# EAGLE design main_board (EAGLE 6.6.0)
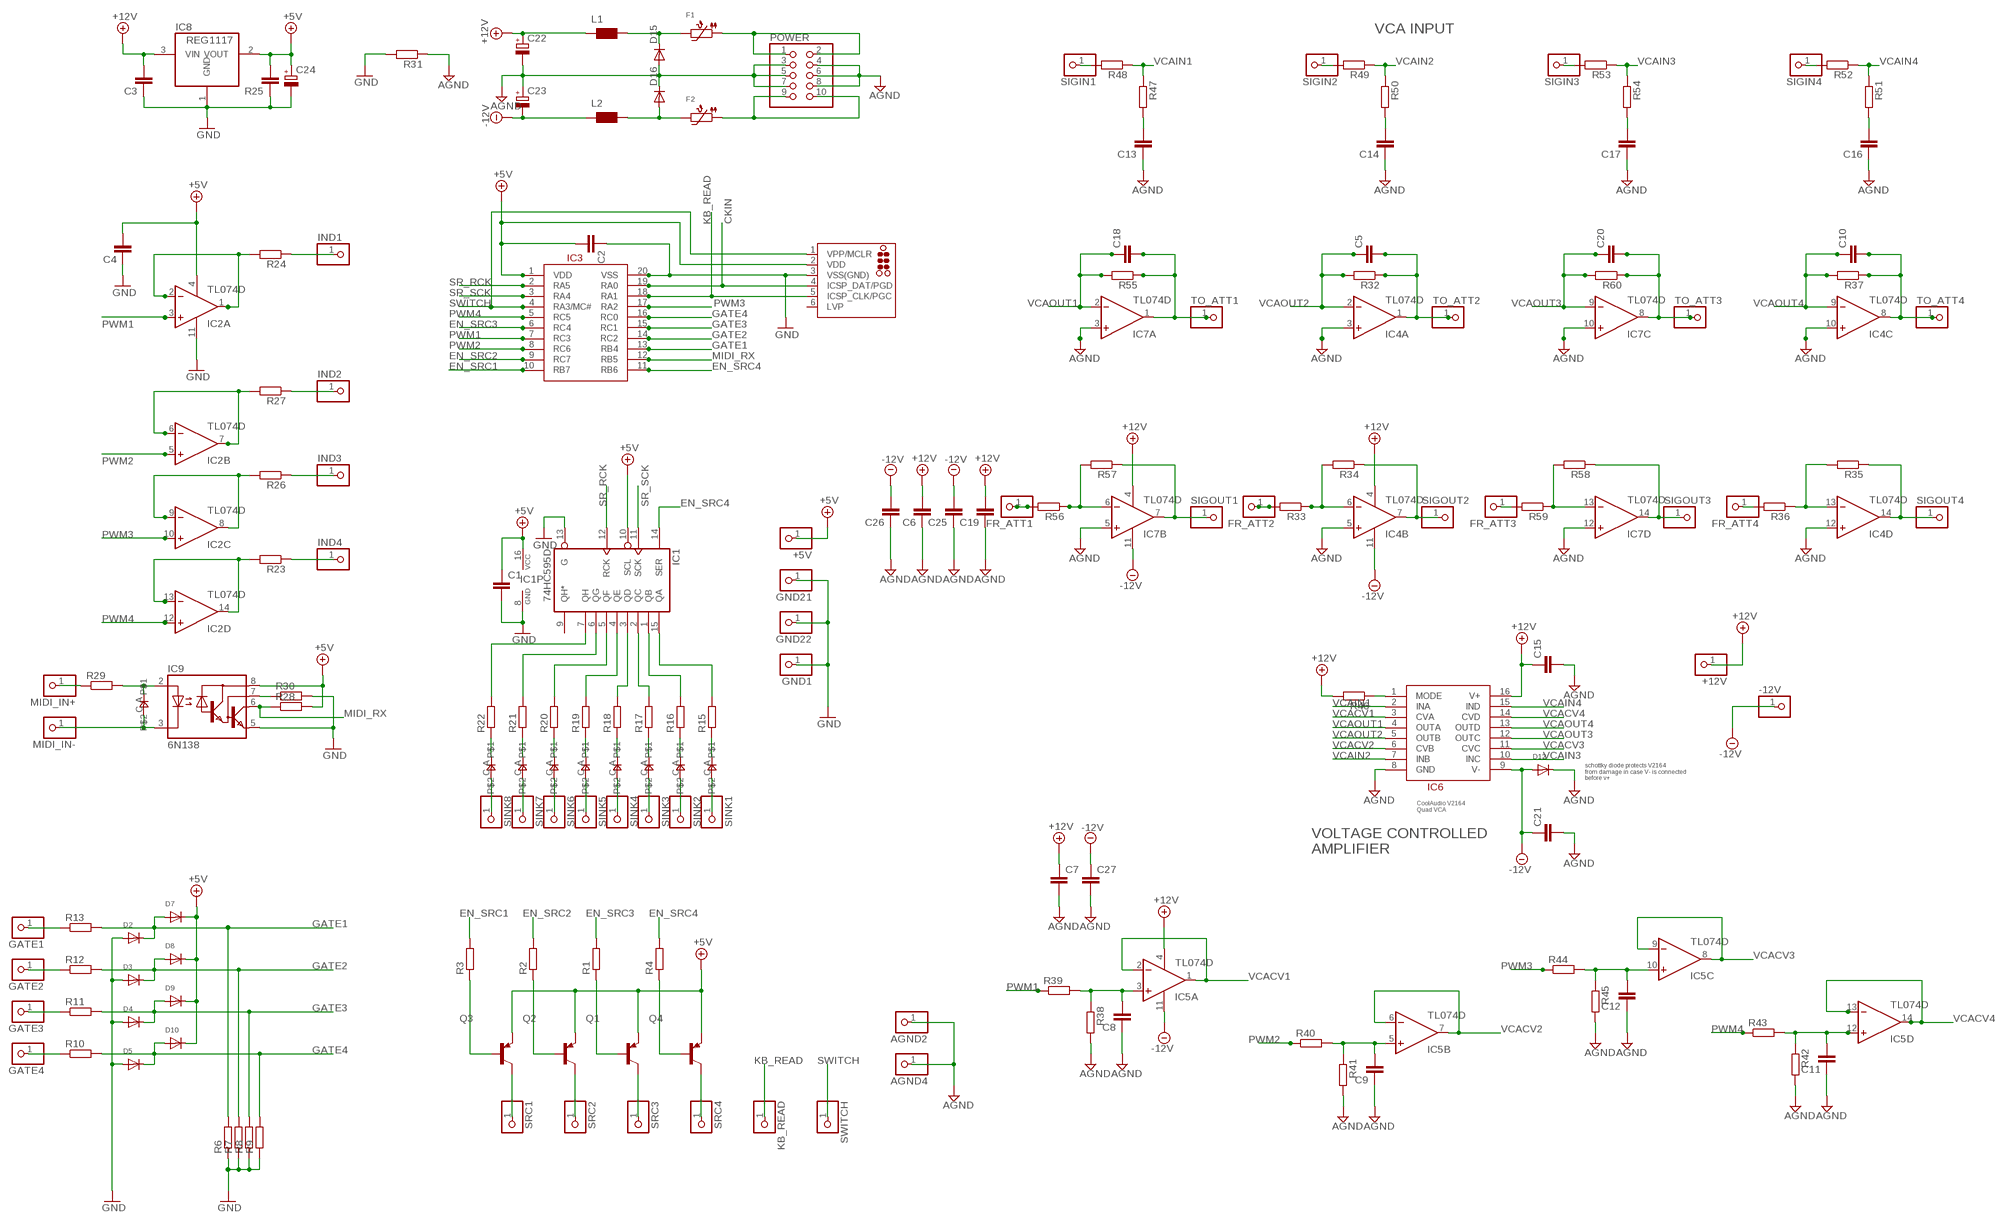
[diagram p0: schematic, sheet 1]

## Parts
+5V  PINHD-1X1  [1X01]
+12V  PINHD-1X1  [1X01]
-12V  PINHD-1X1  [1X01]
AGND2  PINHD-1X1  [1X01]
AGND4  PINHD-1X1  [1X01]
C1  C-EUC0805  [C0805]
C2  C-EUC0805  [C0805]
C3  C-EUC0805  [C0805]
C4  C-EUC0805  [C0805]
C5  C-EUC0805  [C0805]
C6  C-EUC0805  [C0805]
C7  C-EUC0805  [C0805]
C8  C-EUC0805  [C0805]
C9  C-EUC0805  [C0805]
C10  C-EUC0805  [C0805]
C11  C-EUC0805  [C0805]
C12  C-EUC0805  [C0805]
C13  C-EUC0805  [C0805]
C14  C-EUC0805  [C0805]
C15  C-EUC0805  [C0805]
C16  C-EUC0805  [C0805]
C17  C-EUC0805  [C0805]
C18  C-EUC0805  [C0805]
C19  C-EUC0805  [C0805]
C20  C-EUC0805  [C0805]
C21  C-EUC0805  [C0805]
C22  CPOL-EUE2.5-7  [E2,5-7]
C23  CPOL-EUE2.5-7  [E2,5-7]
C24  CPOL-EUE2.5-5  [E2,5-5]
C25  C-EUC0805  [C0805]
C26  C-EUC0805  [C0805]
C27  C-EUC0805  [C0805]
D2  DIODESOD-123  [SOD-123]
D3  DIODESOD-123  [SOD-123]
D4  DIODESOD-123  [SOD-123]
D5  DIODESOD-123  [SOD-123]
D7  DIODESOD-123  [SOD-123]
D8  DIODESOD-123  [SOD-123]
D9  DIODESOD-123  [SOD-123]
D10  DIODESOD-123  [SOD-123]
D11  0805DIODE  [0805DIODE]
D12  DIODESOD-123  [SOD-123]
D13  0805DIODE  [0805DIODE]
D14  0805DIODE  [0805DIODE]
D15  MBR0520LT  [SOD123]
D16  MBR0520LT  [SOD123]
D17  0805DIODE  [0805DIODE]
D18  0805DIODE  [0805DIODE]
D19  0805DIODE  [0805DIODE]
D20  0805DIODE  [0805DIODE]
D21  0805DIODE  [0805DIODE]
D22  0805DIODE  [0805DIODE]
F1  PTC1210  [PTC1210]
F2  PTC1210  [PTC1210]
FR_ATT1  PINHD-1X1  [1X01]
FR_ATT2  PINHD-1X1  [1X01]
FR_ATT3  PINHD-1X1  [1X01]
FR_ATT4  PINHD-1X1  [1X01]
GATE1  PINHD-1X1  [1X01]
GATE2  PINHD-1X1  [1X01]
GATE3  PINHD-1X1  [1X01]
GATE4  PINHD-1X1  [1X01]
GND1  PINHD-1X1  [1X01]
GND21  PINHD-1X1  [1X01]
GND22  PINHD-1X1  [1X01]
IC1  74HC595D  [SO16]
IC2  TL074D  [SO14]
IC3  PIC16F1829SOIC  [SO20W]
IC4  TL074D  [SO14]
IC5  TL074D  [SO14]
IC6  V2164  [SO16]
IC7  TL074D  [SO14]
IC8  REG1117  [SOT223]
IC9  6N138  [DIL08]
ICSP  TC2030-MCP-NL  [TC2030-MCP-NL]
IND1  PINHD-1X1  [1X01]
IND2  PINHD-1X1  [1X01]
IND3  PINHD-1X1  [1X01]
IND4  PINHD-1X1  [1X01]
KB_READ  PINHD-1X1  [1X01]
L1  WE-CBF_0805  [0805]
L2  WE-CBF_0805  [0805]
MIDI_IN+  PINHD-1X1  [1X01]
MIDI_IN-  PINHD-1X1  [1X01]
POWER  PINHD-2X5  [2X05]
Q1  MMBT3906LT1-PNP-SOT23-BEC  [SOT23-BEC]
Q2  MMBT3906LT1-PNP-SOT23-BEC  [SOT23-BEC]
Q3  MMBT3906LT1-PNP-SOT23-BEC  [SOT23-BEC]
Q4  MMBT3906LT1-PNP-SOT23-BEC  [SOT23-BEC]
R1  R-EU_R0805  [R0805]
R2  R-EU_R0805  [R0805]
R3  R-EU_R0805  [R0805]
R4  R-EU_R0805  [R0805]
R6  R-EU_R0805  [R0805]
R7  R-EU_R0805  [R0805]
R8  R-EU_R0805  [R0805]
R9  R-EU_R0805  [R0805]
R10  R-EU_R0805  [R0805]
R11  R-EU_R0805  [R0805]
R12  R-EU_R0805  [R0805]
R13  R-EU_R0805  [R0805]
R15  R-EU_R0805  [R0805]
R16  R-EU_R0805  [R0805]
R17  R-EU_R0805  [R0805]
R18  R-EU_R0805  [R0805]
R19  R-EU_R0805  [R0805]
R20  R-EU_R0805  [R0805]
R21  R-EU_R0805  [R0805]
R22  R-EU_R0805  [R0805]
R23  R-EU_R0805  [R0805]
R24  R-EU_R0805  [R0805]
R25  C-EUC0805  [C0805]
R26  R-EU_R0805  [R0805]
R27  R-EU_R0805  [R0805]
R28  R-EU_R0805  [R0805]
R29  R-EU_R0805  [R0805]
R30  R-EU_R0805  [R0805]
R31  R-EU_R0805  [R0805]
R32  R-EU_R0805  [R0805]
R33  R-EU_R0805  [R0805]
R34  R-EU_R0805  [R0805]
R35  R-EU_R0805  [R0805]
R36  R-EU_R0805  [R0805]
R37  R-EU_R0805  [R0805]
R38  R-EU_R0805  [R0805]
R39  R-EU_R0805  [R0805]
R40  R-EU_R0805  [R0805]
R41  R-EU_R0805  [R0805]
R42  R-EU_R0805  [R0805]
R43  R-EU_R0805  [R0805]
R44  R-EU_R0805  [R0805]
R45  R-EU_R0805  [R0805]
R46  R-EU_R0805  [R0805]
R47  R-EU_R0805  [R0805]
R48  R-EU_R0805  [R0805]
R49  R-EU_R0805  [R0805]
R50  R-EU_R0805  [R0805]
R51  R-EU_R0805  [R0805]
R52  R-EU_R0805  [R0805]
R53  R-EU_R0805  [R0805]
R54  R-EU_R0805  [R0805]
R55  R-EU_R0805  [R0805]
R56  R-EU_R0805  [R0805]
R57  R-EU_R0805  [R0805]
R58  R-EU_R0805  [R0805]
R59  R-EU_R0805  [R0805]
R60  R-EU_R0805  [R0805]
SIGIN1  PINHD-1X1  [1X01]
SIGIN2  PINHD-1X1  [1X01]
SIGIN3  PINHD-1X1  [1X01]
SIGIN4  PINHD-1X1  [1X01]
SIGOUT1  PINHD-1X1  [1X01]
SIGOUT2  PINHD-1X1  [1X01]
SIGOUT3  PINHD-1X1  [1X01]
SIGOUT4  PINHD-1X1  [1X01]
SINK1  PINHD-1X1  [1X01]
SINK2  PINHD-1X1  [1X01]
SINK3  PINHD-1X1  [1X01]
SINK4  PINHD-1X1  [1X01]
SINK5  PINHD-1X1  [1X01]
SINK6  PINHD-1X1  [1X01]
SINK7  PINHD-1X1  [1X01]
SINK8  PINHD-1X1  [1X01]
SRC1  PINHD-1X1  [1X01]
SRC2  PINHD-1X1  [1X01]
SRC3  PINHD-1X1  [1X01]
SRC4  PINHD-1X1  [1X01]
SWITCH  PINHD-1X1  [1X01]
TO_ATT1  PINHD-1X1  [1X01]
TO_ATT2  PINHD-1X1  [1X01]
TO_ATT3  PINHD-1X1  [1X01]
TO_ATT4  PINHD-1X1  [1X01]

## Nets
+5V: +5V.1 C1.1 C2.2 C4.2 C24.+ D7.C D8.C D9.C D10.C IC1.10(SCL) IC1.16(VCC) IC2.4(P:V+) IC3.1(VDD) IC8.2(VOUT) IC9.8(VCC) ICSP.2(VDD) Q1.E Q2.E Q3.E Q4.E R25.2 R28.2
+12V: +12V.1 C3.2 C6.2 C7.1 C15.1 C19.2 C22.+ IC4.4(P:V+) IC5.4(P:V+) IC6.16(V+) IC7.4(P:V+) IC8.3(VIN) L1.1 R46.2
-12V: -12V.1 C21.1 C23.- C25.2 C26.2 C27.1 D12.A IC4.11(P:V-) IC5.11(P:V-) IC6.9(V-) IC7.11(P:V-) L2.1
AGND: AGND2.1 AGND4.1 C6.1 C7.2 C8.1 C9.1 C11.1 C12.1 C13.1 C14.1 C15.2 C16.1 C17.1 C19.1 C21.2 C22.- C23.+ C25.1 C26.1 C27.2 D12.C D15.A D16.C IC4.3(A:+IN) IC4.5(B:+IN) IC4.10(C:+IN) IC4.12(D:+IN) IC6.8(GND) IC7.3(A:+IN) IC7.5(B:+IN) IC7.10(C:+IN) IC7.12(D:+IN) POWER.3 POWER.4 POWER.5 POWER.6 POWER.7 POWER.8 R31.1 R38.2 R41.2 R42.2 R45.2
CKIN: IC3.19(RA0) ICSP.4(ICSP_DAT/PGD)
EN_SRC1: IC3.10(RB7) R3.2
EN_SRC2: IC3.9(RC7) R2.2
EN_SRC3: IC3.6(RC4) R1.2
EN_SRC4: IC1.14(SER) IC3.11(RB6) R4.2
FR_ATT1: FR_ATT1.1 R56.2
GATE1: D2.C D7.A IC3.13(RB4) R6.2 R13.2
GATE2: D3.C D8.A IC3.14(RC2) R7.2 R12.2
GATE3: D4.C D9.A IC3.15(RC1) R8.2 R11.2
GATE4: D5.C D10.A IC3.16(RC0) R9.2 R10.2
GND: C1.2 C2.1 C3.1 C4.1 C24.- D2.A D3.A D4.A D5.A GND1.1 GND21.1 GND22.1 IC1.8(GND) IC1.13(G) IC2.11(P:V-) IC3.20(VSS) IC8.1(GND) IC9.5(GND) ICSP.3(VSS(GND)) R6.1 R7.1 R8.1 R9.1 R25.1 R30.2 R31.2
KB_READ: IC3.18(RA1) ICSP.5(ICSP_CLK/PGC) KB_READ.1
MIDI_RX: IC3.12(RB5) IC9.6(VO) R28.1
N$1: IC1.7(QH) R22.2
N$2: IC1.6(QG) R21.2
N$3: IC1.5(QF) R20.2
N$4: IC1.4(QE) R19.2
N$5: IC1.3(QD) R18.2
N$6: IC1.2(QC) R17.2
N$7: IC1.1(QB) R16.2
N$8: IC1.15(QA) R15.2
N$9: D13.A R22.1
N$10: D14.A R21.1
N$11: D17.A R20.1
N$12: D18.A R19.1
N$13: D19.A R18.1
N$14: D20.A R17.1
N$15: D21.A R16.1
N$16: D22.A R15.1
N$17: Q3.C SRC1.1
N$18: Q2.C SRC2.1
N$19: Q1.C SRC3.1
N$20: Q4.C SRC4.1
N$21: IC6.1(MODE) R46.1
N$22: Q3.B R3.1
N$23: Q2.B R2.1
N$24: Q1.B R1.1
N$25: Q4.B R4.1
N$26: D13.C SINK8.1
N$27: IC7.6(B:-IN) R56.1 R57.2
N$28: IC7.7(B:OUT) R57.1 SIGOUT1.1
N$29: D14.C SINK7.1
N$30: IC7.13(D:-IN) R58.2 R59.1
N$31: IC7.14(D:OUT) R58.1 SIGOUT3.1
N$32: D15.C F1.P$2 L1.2
N$33: IC4.6(B:-IN) R33.1 R34.2
N$34: IC4.7(B:OUT) R34.1 SIGOUT2.1
N$35: D16.A F2.P$2 L2.2
N$36: IC4.13(D:-IN) R35.2 R36.1
N$37: IC4.14(D:OUT) R35.1 SIGOUT4.1
N$38: C13.2 R47.2
N$39: R48.2 SIGIN1.1
N$40: C14.2 R50.2
N$41: R49.2 SIGIN2.1
N$42: C17.2 R54.2
N$43: R53.2 SIGIN3.1
N$44: C16.2 R51.2
N$45: R52.2 SIGIN4.1
N$46: IND1.1 R24.1
N$47: IC2.1(A:OUT) IC2.2(A:-IN) R24.2
N$48: C8.2 IC5.3(A:+IN) R38.1 R39.2
N$49: D17.C SINK6.1
N$50: IC2.6(B:-IN) IC2.7(B:OUT) R27.2
N$51: IND2.1 R27.1
N$52: C9.2 IC5.5(B:+IN) R40.2 R41.1
N$53: IC2.8(C:OUT) IC2.9(C:-IN) R26.2
N$54: IND3.1 R26.1
N$55: C12.2 IC5.10(C:+IN) R44.2 R45.1
N$56: IC2.13(D:-IN) IC2.14(D:OUT) R23.2
N$57: IND4.1 R23.1
N$58: C11.2 IC5.12(D:+IN) R42.1 R43.2
N$59: D18.C SINK5.1
N$60: FR_ATT2.1 R33.2
N$61: GATE1.1 R13.1
N$62: IC9.7(VB) R30.1
N$63: F2.P$1 POWER.9 POWER.10
N$64: D11.A IC9.2(A) R29.2
N$65: D11.C IC9.3(C) MIDI_IN-.1
N$66: MIDI_IN+.1 R29.1
N$67: GATE2.1 R12.1
N$68: GATE3.1 R11.1
N$69: GATE4.1 R10.1
N$70: FR_ATT3.1 R59.2
N$71: FR_ATT4.1 R36.2
N$72: D19.C SINK4.1
N$73: D20.C SINK3.1
N$75: F1.P$1 POWER.1 POWER.2
N$76: D21.C SINK2.1
N$77: D22.C SINK1.1
PWM1: IC2.3(A:+IN) IC3.7(RC3) R39.1
PWM2: IC2.5(B:+IN) IC3.8(RC6) R40.1
PWM3: IC2.10(C:+IN) IC3.17(RA2) R44.1
PWM4: IC2.12(D:+IN) IC3.5(RC5) R43.1
SR_RCK: IC1.12(RCK) IC3.2(RA5)
SR_SCK: IC1.11(SCK) IC3.3(RA4)
SWITCH: IC3.4(RA3/MC#) ICSP.1(VPP/MCLR) SWITCH.1
TO_ATT1: C18.2 IC7.1(A:OUT) R55.1 TO_ATT1.1
TO_ATT2: C5.2 IC4.1(A:OUT) R32.1 TO_ATT2.1
TO_ATT3: C20.2 IC7.8(C:OUT) R60.1 TO_ATT3.1
TO_ATT4: C10.2 IC4.8(C:OUT) R37.1 TO_ATT4.1
VCACV1: IC5.1(A:OUT) IC5.2(A:-IN) IC6.3(CVA)
VCACV2: IC5.6(B:-IN) IC5.7(B:OUT) IC6.6(CVB)
VCACV3: IC5.8(C:OUT) IC5.9(C:-IN) IC6.11(CVC)
VCACV4: IC5.13(D:-IN) IC5.14(D:OUT) IC6.14(CVD)
VCAIN1: IC6.2(INA) R47.1 R48.1
VCAIN2: IC6.7(INB) R49.1 R50.1
VCAIN3: IC6.10(INC) R53.1 R54.1
VCAIN4: IC6.15(IND) R51.1 R52.1
VCAOUT1: C18.1 IC6.4(OUTA) IC7.2(A:-IN) R55.2
VCAOUT2: C5.1 IC4.2(A:-IN) IC6.5(OUTB) R32.2
VCAOUT3: C20.1 IC6.12(OUTC) IC7.9(C:-IN) R60.2
VCAOUT4: C10.1 IC4.9(C:-IN) IC6.13(OUTD) R37.2
Unconnected: IC1.9(QH*) ICSP.6(LVP)

## Notes on the sheet
- VCA INPUT
- schottky diode protects V2164
  from damage in case V- is connected
  before v+
- CoolAudio V2164
  Quad VCA
- VOLTAGE CONTROLLED
  AMPLIFIER

## Library data of the parts
+5V +12V -12V AGND2 AGND4 FR_ATT1-FR_ATT4 GATE1-GATE4 GND1 GND21 GND22 IND1-IND4 KB_READ MIDI_IN+ MIDI_IN- SIGIN1-SIGIN4 SIGOUT1-SIGOUT4 SINK1-SINK8 SRC1-SRC4 SWITCH TO_ATT1-TO_ATT4 = pinhead:PINHD-1X1: PIN HEADER
C1-C21 C25-C27 R25 = rcl:C-EU: CAPACITOR, European symbol
C22-C24 = rcl:CPOL-EU: POLARIZED CAPACITOR, European symbol
D2-D5 D7-D10 D12 = microbuilder:DIODE: Diode SMADIODE - SMA Surface Mount Package 20V 1A Schottky Diode Digikey (500mV @ 1A, 500uA Vr @ 20V): 641-1014-6-ND 10V 2A Schottky Diode Digikey (350mV @ 2A, 700uA Vr @ 10V): MBRA210LT3 SOD-123 30V 200mA (800mV Vf, 2uA Vr @ 25V) Schottky Diode (very fast switching for boost, etc.) - Digikey: BAT54T1GOSTR-ND 30V 500mA (430mV Vf, 130uA Vr @ 30V) Schottky Diode - Digikey: B0530W-FDICT-ND MBR120 1A 20V (0.34Vf) Schottky Diode - Digikey: MBR120VLSFT1GOSCT-ND SOD-323 10V 570mA (380mV Vf, 3ns) Schottky Diode - Digikey: ZLLS410CT-ND 1N4148WS - 75V 150mA (1V Vf @ 10mA, 4ns) Simple Diode - Digikey: 1N4148WSFSCT-ND, Mouser: 512-1N4148WS SOD-523 BAT54 30V 200mA Schottky (0.8 Vf @ 100mA, 5ns) - Digikey: BAT54XV2CT-ND 30V 30mA Schottky Diode (RB751S-40TE61) - Digikey: RB751S-40TE61CT-ND SOT23-R/W - SOT23 Package (R = Solder Paste/Reflow Ovens, W = Hand-Soldering) BAT54Film 40V 300mA - Digikey: 497-7162-1-ND DO-1N4148 Through Hole Small Current Diode (any model)
D11 D13 D14 D17-D22 = jasons_stuff:0805DIODE
D15 D16 = diode:MBR0520LT: SCHOTTKY BARRIER RECTIFIER Source: http://onsemi.com .. MBR0520LT1-D.pdf
F1 F2 = microbuilder:PTC: PTC (Resettable Fuse) 1206 Package 250mA PTC (16V Max, Time-to-Trip: 0.08s) - Digikey: F2110CT-ND 1210 Package 100mA PTC (30V Max, Time-to-Trip: 0.6s) - Digikey: MF-USMF010-2CT-ND 1812 Package 750mA PTC (24V Max, Time-to-Trip: 0.2s) - Digikey: MF-MSMF075/24-2CT-ND
IC1 = 74xx-eu:74*595: 8-bit SHIFT REGISTER, output latch
IC2 IC4 IC5 IC7 = linear:TL074: OP AMP
IC3 = jason_eagle6:PIC16F1829
IC6 = jason_eagle6:V2164
IC8 = burr-brown:REG1117: 800mA and 1A Low Dropout (LDO) Positive Regulator 1.8V, 2.5V, 2.85V, 3.3V, 5V, and Adj; MPN: REG1117; OC_FARNELL: 1097566; OC_NEWARK: 14P6981
IC9 = optocoupler:6N138: MOTOROLA OPTO COUPLER; MF: VISHAY/TELEFUNKEN; MPN: 6N138; OC_FARNELL: 9860150; OC_NEWARK: 35K5294
ICSP = tag-connect:TC2030: TAG-CONNECT ICSP Connector Manufacturer: Tag-Connect <http://www.tag-connect.com> Cable for easy In-Circuit Serial Programming. Designed for Microchip ICD2, suitable for many others. Two variants - one "with legs" (for hands-free fit on PCB) and another "without legs" for quick programming. PAD Description 1 MCLR/Vpp 2 Vdd 3 GND 4 PGD (ISPDAT) 5 PGC (ISPCLK) 6 nc (used for LVP) ©2009 ROFA.cz - modified and updated by Robert Darlington ‹rdarlington@gmail.com›
L1 L2 = wuerth-elektronik:WE-CBF: SMD EMI Suppression Ferrite Beads - excellent anti-EMI properties - low DCR - impedances till 3000 ohms - rated current up to 6 A
POWER = pinhead:PINHD-2X5: PIN HEADER
Q1-Q4 = transistor:*-PNP-: PNP Transistror
R1-R4 R6-R13 R15-R24 R26-R60 = rcl:R-EU_: RESISTOR, European symbol

## Board
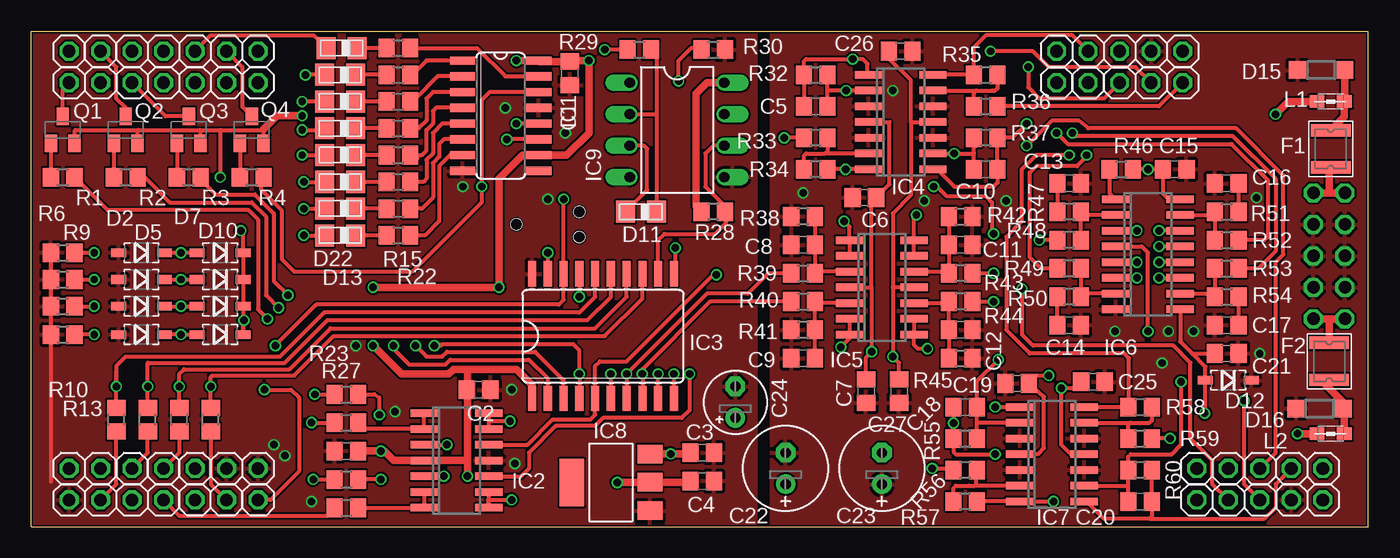
[diagram p1: board, top side]
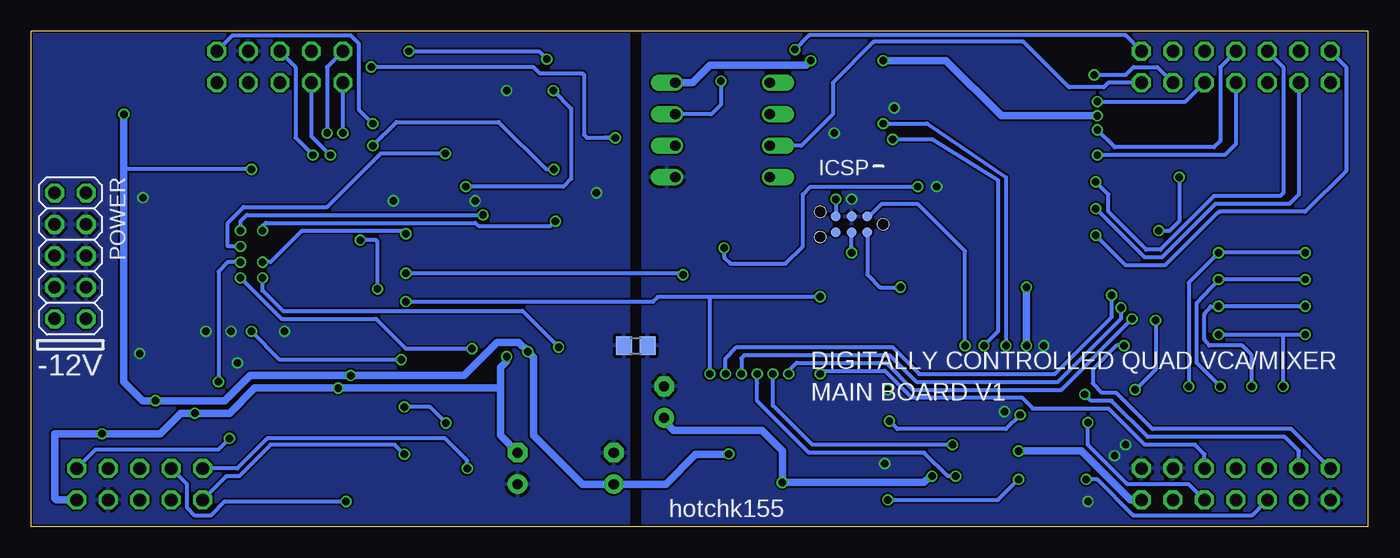
[diagram p2: board, bottom side, seen from below]

Size 107.84 x 39.98 mm. Coordinates in mm from the lower left corner, seen from the top.
Outline: 0,39.98 107.84,39.98 107.84,0 0,0 0,39.98
Copper layers (1*16): Top 0.035mm / dielectric 1.5mm / Bottom 0.035mm
Design rules "hackvana": minimum track width 6mil, minimum drill 0.3mm, track to track 6mil, track to pad 9mil, pad to pad 6mil, via to via 6mil, smd to smd 0mil, copper to edge 6mil, drill to drill 6mil, minimum pad ring 10mil, minimum via ring 6mil, stop-mask expansion 2mil, vias tented up to drill 100mil, thermal gap 10mil

### Footprints (pad centres in the part's own frame; a part is rotated, then mirrored left to right if it is on the bottom)
1X01 = drill 1.016 octagon: 1 0,0
C0805 = smd 1.3 x 1.5: 1 -0.95,0; 2 0.95,0
E2,5-7 = drill 0.813 pad 1.6: + -1.27,0 | drill 0.813 pad 1.6 octagon: - 1.27,0
E2,5-5 = drill 0.813 pad 1.6: + -1.27,0 | drill 0.813 pad 1.6 octagon: - 1.27,0
SOD-123 = smd 1.2 x 0.7: A 1.85,0; C -1.85,0
0805DIODE = smd 1.524 x 1.778: A -1.262,-0.005; C 1.238,-0.005
SOD123 = smd 1.4 x 1.4: A 1.9,0; C -1.9,0
PTC1210 = smd 1 x 3.2: P$1 -1.5,0; P$2 1.5,0
SO16 = smd 0.66 x 2.032: 1 -4.445,-3.073; 2 -3.175,-3.073; 3 -1.905,-3.073; 4 -0.635,-3.073; 5 0.635,-3.073; 6 1.905,-3.073; 7 3.175,-3.073; 8 4.445,-3.073; 9 4.445,3.073; 10 3.175,3.073; 11 1.905,3.073; 12 0.635,3.073; 13 -0.635,3.073; 14 -1.905,3.073; 15 -3.175,3.073; 16 -4.445,3.073
SO14 = smd 0.6 x 2.2: 1 -3.81,-2.6; 2 -2.54,-2.6; 3 -1.27,-2.6; 4 0,-2.6; 5 1.27,-2.6; 6 2.54,-2.6; 7 3.81,-2.6; 8 3.81,2.6; 9 2.54,2.6; 10 1.27,2.6; 11 0,2.6; 12 -1.27,2.6; 13 -2.54,2.6; 14 -3.81,2.6
SO20W = smd 0.66 x 2.032: 1 -5.715,-5.029; 2 -4.445,-5.029; 3 -3.175,-5.029; 4 -1.905,-5.029; 5 -0.635,-5.029; 6 0.635,-5.029; 7 1.905,-5.029; 8 3.175,-5.029; 9 4.445,-5.029; 10 5.715,-5.029; 11 5.715,5.029; 12 4.445,5.029; 13 3.175,5.029; 14 1.905,5.029; 15 0.635,5.029; 16 -0.635,5.029; 17 -1.905,5.029; 18 -3.175,5.029; 19 -4.445,5.029; 20 -5.715,5.029
SO16' = smd 0.6 x 2.2: 1 -4.445,-2.6; 2 -3.175,-2.6; 3 -1.905,-2.6; 4 -0.635,-2.6; 5 0.635,-2.6; 6 1.905,-2.6; 7 3.175,-2.6; 8 4.445,-2.6; 9 4.445,2.6; 10 3.175,2.6; 11 1.905,2.6; 12 0.635,2.6; 13 -0.635,2.6; 14 -1.905,2.6; 15 -3.175,2.6; 16 -4.445,2.6
SOT223 = smd 1.499 x 2.007: 1 -2.261,-3.15; 2 0.025,-3.15; 3 2.311,-3.15 | smd 3.81 x 2.007: 4 0,3.15
DIL08 = drill 0.813 offset: 1 -3.81,-3.81; 2 -1.27,-3.81; 3 1.27,-3.81; 4 3.81,-3.81; 5 3.81,3.81; 6 1.27,3.81; 7 -1.27,3.81; 8 -3.81,3.81
TC2030-MCP-NL = smd 0.787 x 0.787: 1 1.27,-0.635; 2 1.27,0.635; 3 2.54,-0.635; 4 2.54,0.635; 5 3.81,-0.635; 6 3.81,0.635 | hole 0.889: 0,0; 5.08,-1.016; 5.08,1.016
0805 = smd 1.2 x 1: 1 -1.1,0; 2 1.1,0
2X05 = drill 1.016 octagon: 1 -5.08,-1.27; 2 -5.08,1.27; 3 -2.54,-1.27; 4 -2.54,1.27; 5 0,-1.27; 6 0,1.27; 7 2.54,-1.27; 8 2.54,1.27; 9 5.08,-1.27; 10 5.08,1.27
SOT23-BEC = smd 1 x 1.4: B -0.95,-1.1; C 0,1.1; E 0.95,-1.1
R0805 = smd 1.3 x 1.5: 1 -0.95,0; 2 0.95,0

### Placement (x,y rotation side)
+5V  18.31,2.16 0 top
+12V  99.08,2.16 0 top
-12V  104.16,2.16 0 top
AGND2  101.62,2.16 0 top
AGND4  90.32,38.35 0 top
C1  43.45,36.58 270 top
C2  36.09,11.05 180 top
C3  54.12,5.97 180 top
C4  54.12,3.68 180 top
C5  63.26,33.91 180 top
C6  67.2,26.54 0 top
C7  67.33,10.92 270 top
C8  62.25,22.73 0 top
C9  62.25,13.59 0 top
C10  76.98,28.83 0 top
C11  74.95,22.73 180 top
C12  74.95,15.88 180 top
C13  83.71,27.69 180 top
C14  83.71,16.26 180 top
C15  92.22,28.83 0 top
C16  96.41,27.69 0 top
C17  96.41,16.26 0 top
C18  75.33,9.65 180 top
C19  79.52,11.56 0 top
C20  89.43,2.03 0 top
C21  96.41,13.97 0 top
C22  60.85,4.7 90 top
C23  68.6,4.7 90 top
C24  56.79,10.03 90 top
C25  85.62,11.68 180 top
C26  70.12,38.35 180 top
C27  70,10.92 270 top
D2  8.91,22.1 180 top
D3  8.91,19.94 180 top
D4  8.91,17.78 180 top
D5  8.91,15.49 180 top
D7  15.26,22.1 180 top
D8  15.26,19.94 180 top
D9  15.26,17.78 180 top
D10  15.26,15.49 180 top
D11  49.17,25.4 180 top
D12  96.54,11.81 180 top
D13  24.91,23.49 180 top
D14  24.91,25.65 180 top
D15  104.03,36.83 180 top
D16  103.9,9.52 0 top
D17  24.91,27.81 180 top
D18  24.91,29.97 180 top
D19  24.91,32.13 180 top
D20  24.91,34.29 180 top
D21  24.91,36.45 180 top
D22  25.04,38.61 180 top
F1  104.79,30.48 90 top
F2  104.67,13.34 270 top
FR_ATT1  94,4.7 0 top
FR_ATT2  87.78,35.81 0 top
FR_ATT3  104.16,4.7 0 top
FR_ATT4  92.86,35.81 0 top
GATE1  15.77,2.16 180 top
GATE2  10.69,4.7 0 top
GATE3  8.15,4.7 180 top
GATE4  5.61,2.16 0 top
GND1  15.77,4.7 0 top
GND21  3.07,2.16 0 top
GND22  18.31,4.7 0 top
IC1  37.86,33.15 270 top
IC2  34.31,5.33 270 top
IC3  46.12,15.37 0 top
IC4  70.12,32.64 270 top
IC5  68.6,19.3 270 top
IC6  V2164  [SO16']  90.06,21.97 270 top
IC7  82.31,5.84 270 top
IC8  46.75,3.56 90 top
IC9  52.09,32 270 top
ICSP  39.13,24.38 180 bottom
IND1  13.23,2.16 180 top
IND2  10.69,2.16 0 top
IND3  8.15,2.16 0 top
IND4  5.61,4.7 0 top
KB_READ  3.07,4.7 0 top
L1  104.79,34.29 0 top
L2  104.79,7.49 0 top
MIDI_IN+  18.31,38.35 0 top
MIDI_IN-  18.31,35.81 0 top
POWER  104.67,21.84 270 bottom
Q1  2.56,32 0 top
Q2  7.64,32 0 top
Q3  12.72,32 0 top
Q4  17.8,32 0 top
R1  2.56,28.19 0 top
R2  7.64,28.19 0 top
R3  12.72,28.19 0 top
R4  17.8,28.19 0 top
R6  2.56,22.1 0 top
R7  2.56,19.94 0 top
R8  2.56,17.78 0 top
R9  2.56,15.49 0 top
R10  6.88,8.64 90 top
R11  9.42,8.64 90 top
R12  11.96,8.64 90 top
R13  14.5,8.64 90 top
R15  29.61,38.61 0 top
R16  29.61,36.45 0 top
R17  29.61,34.29 0 top
R18  29.61,32.13 0 top
R19  29.61,29.97 0 top
R20  29.61,27.81 0 top
R21  29.61,25.65 0 top
R22  29.61,23.49 0 top
R23  25.42,10.67 0 top
R24  25.42,8.38 0 top
R25  25.42,6.1 0 top
R26  25.42,3.81 0 top
R27  25.42,1.52 0 top
R28  55.01,25.4 180 top
R29  49.04,38.48 0 top
R30  55.01,38.48 0 top
R31  59.07,14.6 0 bottom
R32  63.26,36.45 0 top
R33  63.26,31.37 180 top
R34  63.26,28.83 180 top
R35  76.98,36.45 0 top
R36  76.98,33.91 0 top
R37  76.98,31.37 180 top
R38  62.25,25.02 180 top
R39  62.25,20.45 0 top
R40  62.25,18.16 0 top
R41  62.25,15.88 180 top
R42  74.95,25.02 0 top
R43  74.95,20.45 180 top
R44  74.95,18.16 180 top
R45  74.95,13.59 0 top
R46  87.9,28.83 0 top
R47  83.71,25.4 180 top
R48  83.71,23.11 180 top
R49  83.71,20.83 180 top
R50  83.71,18.54 180 top
R51  96.41,25.4 0 top
R52  96.41,23.11 0 top
R53  96.41,20.83 0 top
R54  96.41,18.54 0 top
R55  75.33,7.11 0 top
R56  75.33,4.57 180 top
R57  75.33,2.03 180 top
R58  89.43,9.65 0 top
R59  89.43,7.11 0 top
R60  89.43,4.57 180 top
SIGIN1  96.54,2.16 0 top
SIGIN2  87.78,38.35 0 top
SIGIN3  82.7,38.35 0 top
SIGIN4  82.7,35.81 0 top
SIGOUT1  96.54,4.7 0 top
SIGOUT2  99.08,4.7 0 top
SIGOUT3  85.24,35.81 180 top
SIGOUT4  85.24,38.35 0 top
SINK1  13.23,38.35 0 top
SINK2  15.77,35.81 0 top
SINK3  13.23,35.81 0 top
SINK4  10.69,38.35 0 top
SINK5  10.69,35.81 0 top
SINK6  8.15,38.35 0 top
SINK7  5.61,35.81 0 top
SINK8  3.07,38.35 0 top
SRC1  8.15,35.81 0 top
SRC2  5.61,38.35 180 top
SRC3  3.07,35.81 0 top
SRC4  15.77,38.35 0 top
SWITCH  13.23,4.7 180 top
TO_ATT1  94,2.16 0 top
TO_ATT2  90.32,35.81 0 top
TO_ATT3  101.62,4.7 0 top
TO_ATT4  92.86,38.35 0 top

### Tracks (layer width: path | path; a pad name or v marks a point on that pad's centre or on a via)
+5V  (via drill 0.6)
  Top 0.305: Q1.E 3.51,31.94 3.57,32 8.65,32 | 8.65,32 13.61,32 | 13.61,32 15.26,32 | 15.26,32 18.69,32 18.75,31.94 | Q4.E 18.75,31.94 | Q3.E 13.67,31.94 13.61,32 | Q2.E 8.59,31.94 8.65,32 | 15.26,32 v15.26,28.19 | IC1.16 40.91,37.59 40.79,37.72 | v17.16,16.64 17.11,16.58 D10.C D9.C D8.C D7.C 17.11,23.68 v16.91,23.88 | v18.81,11.05 20.97,11.05 21.61,10.41 21.61,4.45 19.32,2.16 +5V.1 | 18.75,31.94 18.75,32.06 | R28.2 53.61,25.85
  Top 0.61: v47.26,3.56 49.88,3.56 IC8.2 52.56,3.58 C4.2 | IC9.8 54.5,35.81 53.61,34.92 53.61,25.85 | v39.13,37.59 IC1.16 41,37.53 C1.1 43.52,37.59 v44.98,37.59 44.98,31.75 43.2,29.97 IC1.10 39.64,29.97 37.74,28.07 v37.74,19.3 v27.58,19.3 | v21.86,33.15 19.83,33.15 18.75,32.06 | v27.58,14.6 29.86,12.32 33.67,12.32 34.05,12.7 35.2,12.7 | IC3.1 40.4,11.43 39.13,12.7 35.2,12.7 | v35.2,4.06 35.2,5.33 | 35.2,5.33 IC2.4 29.23,5.33 28.47,6.1 v28.21,6.1 R25.2 | 35.2,5.33 35.2,11.3 35.14,11.24 C2.2 34.94,11.24 35.2,11.5 35.2,12.7
  Bottom 0.305: v15.26,28.19 15.26,24.64 15.77,24.13 16.02,23.88 v16.91,23.88 | +5V.1 19.32,2.16 | v17.16,16.64 17.16,12.7 v18.81,11.05 | ICSP.2 40.4,20.32 39.39,19.3 v37.74,19.3
  Bottom 0.61: v35.2,4.06 35.32,4.06 35.83,3.56 v47.26,3.56 47.26,6.1 48.91,7.75 56.03,7.75 56.79,8.51 C24.+ | IC9.8 54.5,35.81 53.1,37.21 45.36,37.21 v44.98,37.59 | v21.86,33.15 29.61,33.15 34.05,37.59 v39.13,37.59 | v27.58,14.6 v27.58,19.3 | v28.21,6.1 23.13,6.1 19.2,2.16 +5V.1
+12V  (via drill 0.6)
  Top 0.305: IC4.4 69.23,32.64 69.23,27.62 C6.2 67.78,26.17 67.78,19.3 | IC6.16 91.71,26.42 91.27,26.86 C15.1 v90.06,28.83 R46.2 | 67.78,19.3 v67.78,14.12 67.33,13.67 C7.1 | IC5.4 67.78,19.3 | +12V.1 97.81,3.43 v97.81,10.16 | IC7.4 81.17,5.84 81.68,6.35 81.68,10.48 C19.2 80.6,12 80.79,12.19 v82.06,12.19
  Top 0.61: C3.2 52.56,5.87 v51.58,5.87 IC8.3 | L1.1 101.36,34.29 v100.35,33.27
  Bottom 0.305: v90.06,28.83 100.35,28.83
  Bottom 0.61: v100.35,33.27 100.35,28.83 100.35,11.68 98.82,10.16 v97.81,10.16 92.22,10.16 90.19,12.19 v82.06,12.19 72.92,12.19 70.25,14.86 68.52,14.86 v67.78,14.12 67.33,13.67 67.33,7.37 63.39,3.43 C22.+ 56.66,3.43 54.25,5.84 51.61,5.84 v51.58,5.87
-12V  (via drill 0.6)
  Top 0.305: 70.95,32.64 70.95,26.73 69.49,25.27 69.49,19.3 | 70.95,32.64 IC4.11 | IC6.9 92.66,14.93 93.62,13.97 | 93.62,13.97 C21.1 | 93.62,13.97 94.69,12.9 D12.A 94.63,11.76 v94.63,9.14 | 69.49,19.3 v69.49,13.72 70,13.21 C27.1 | IC5.11 69.49,19.3 | IC7.11 83.84,5.84 83.08,6.6 v83.08,11.18 84.29,11.18 C25.2 84.79,11.18 | 70.95,32.64 70.95,36.01 69.11,37.85 69.11,38.29 C26.2
  Top 0.61: L2.1 v102.13,7.49
  Bottom 0.61: 70,11.18 v83.08,11.18 89.81,11.18 91.84,9.14 v94.63,9.14 95.78,9.14 97.43,7.49 100.35,7.49 v102.13,7.49 105.94,7.49 105.94,2.29 105.81,2.16 -12V.1 | 70,11.18 70,12.83 69.49,13.34 v69.49,13.72 | C23.- 70,7.37 70,11.18
AGND  (via drill 0.6)
  other vias: 69.49,35.18 62.25,26.92 98.82,26.54 93.74,15.75 99.08,13.97 87.39,15.75 91.71,15.75 91.2,13.21 72.03,26.29 78.63,26.29
  pour Top: 59.71,42.16 59.71,-3.56 110.51,-3.56 110.51,42.16
  pour Bottom: 59.71,43.43 59.71,-2.29 110.51,-2.29 110.51,43.43
CKIN  (via drill 0.6)
  Top 0.305: IC3.19 v41.67,22.1
  Bottom 0.305: v41.67,22.1 ICSP.4
EN_SRC1  (via drill 0.6)
  Top 0.305: R3.2 13.67,28.01 14.88,26.8 18.05,26.8 19.58,25.27 19.58,19.81 v20.72,18.67 | IC3.10 v51.83,12.32
  Bottom 0.305: v51.83,12.32 51.83,13.59 50.95,14.48 38.37,14.48 36.21,12.32 25.29,12.32 20.72,16.89 v20.72,18.67
EN_SRC2  (via drill 0.6)
  Top 0.305: R2.2 9.16,28.19 11.19,26.16 17.8,26.16 18.94,25.02 18.94,18.67 v19.96,17.65 19.7,17.91 | IC3.9 v50.56,12.32
  Bottom 0.305: 50.56,12.7 v50.56,12.32 50.56,13.59 50.31,13.84 38.63,13.84 36.47,11.68 25.04,11.68 19.96,16.76 v19.96,17.65
EN_SRC3  (via drill 0.6)
  Top 0.305: R1.2 6.18,25.53 17.54,25.53 18.31,24.77 18.31,17.53 v19.07,16.76 | IC3.6 v46.75,12.32
  Bottom 0.305: v46.75,12.32 46.75,12.57 46.12,13.21 38.88,13.21 36.72,11.05 24.78,11.05 v19.07,16.76
EN_SRC4  (via drill 0.6)
  Top 0.305: IC1.14 36.98,35.05 36.34,34.42 v36.34,27.43 36.34,26.16 30.75,20.57 21.23,20.57 20.21,21.59 20.21,25.53 18.56,27.18 18.56,28.01 R4.2 | IC3.11 51.96,20.52 v51.96,22.48
  Bottom 0.305: v51.96,22.48 51.96,21.72 51.45,21.21 47.01,21.21 45.61,22.61 45.61,26.8 44.98,27.43 v36.34,27.43
FR_ATT1  (via drill 0.6)
  Top 0.305: v72.66,4.7 74.25,4.7 R56.2
  Bottom 0.305: v72.66,4.7 72.66,5.33 74.44,7.11 88.79,7.11 91.2,4.7 FR_ATT1.1
GATE1  (via drill 0.6)
  Top 0.305: R6.2 v5.1,22.1 | D7.A 12.72,22.1 v12.08,22.1 D2.C | R13.2 v14.5,11.3 14.5,12.06 14.62,12.19 21.23,12.19 24.4,15.37 46.25,15.37 49.29,18.41 IC3.13
  Bottom 0.305: v5.1,22.1 v12.08,22.1 14.5,19.68 v14.5,11.3
GATE2  (via drill 0.6)
  Top 0.305: R7.2 v5.1,19.94 | D8.A v12.08,19.94 D3.C | R12.2 v11.96,11.3 11.96,12.32 12.34,12.7 20.85,12.7 24.15,16 45.48,16 48.02,18.54 IC3.14
  Bottom 0.305: v5.1,19.94 v12.08,19.94 13.86,18.03 13.86,13.21 v11.96,11.3 11.96,11.43
GATE3  (via drill 0.6)
  Top 0.305: R8.2 v5.1,17.78 | D9.A 12.72,17.78 v12.08,17.78 D4.C | R11.2 v9.42,11.3 9.42,13.21 20.47,13.21 23.89,16.64 44.85,16.64 46.75,18.54 IC3.15
  Bottom 0.305: v5.1,17.78 v12.08,17.78 12.72,17.78 13.23,17.14 13.23,15.11 12.85,14.6 10.18,14.6 9.42,13.84 v9.42,11.3
GATE4  (via drill 0.6)
  Top 0.305: D10.A v12.08,15.49 D5.C | v5.1,15.49 R9.2 | R10.2 v6.88,11.3 | v6.88,11.3 6.88,12.57 | v6.88,11.3 6.88,12.95 7.64,13.72 20.08,13.72 23.64,17.27 44.21,17.27 45.48,18.54 IC3.16
  Bottom 0.305: v12.08,15.49 6.88,15.49 | 6.88,15.49 v5.1,15.49 | v6.88,11.3 6.88,15.49
GND  (via drill 0.6)
  Top 0.305: R6.1 R7.1 R8.1 R9.1 1.61,3.62
  other vias: 38.25,33.78 34.82,27.43 41.67,26.42 19.58,6.6 20.47,5.71 22.62,2.03 39.01,5.08 26.18,14.6 29.36,9.27 43.07,31.75 38.75,11.05
  pour Top: -2.52,40.89 -2.52,-2.29 57.17,-2.29 58.44,-2.29 58.44,43.43 -2.52,43.43
  pour Bottom: -3.79,43.43 -3.79,-2.29 58.44,-2.29 58.44,43.43
KB_READ  (via drill 0.6)
  Top 0.305: v19.7,14.6 23.01,17.91 42.56,17.91 42.94,18.29 IC3.18 v42.94,26.42
  Bottom 0.305: KB_READ.1 6.24,7.87 17.42,7.87 20.34,10.8 21.48,10.8 22.24,11.56 22.24,12.7 20.34,14.6 v19.7,14.6 | v42.94,26.42 ICSP.5
MIDI_RX
  Top 0.305: IC3.12 50.56,23.11 51.07,23.62 55.14,23.62 56.03,24.51 56.03,25.33 R28.1 55.96,25.85 54.37,27.43 54.37,30.1 55.01,30.73 IC9.6
N$1
  Top 0.305: IC1.7 33.8,29.97 32.91,29.08 32.91,24.64 31.77,23.49 R22.2
N$2
  Top 0.305: IC1.6 33.29,31.24 32.91,30.86 32.91,29.84 32.4,29.34 32.4,26.54 31.51,25.65 R21.2
N$3
  Top 0.305: IC1.5 33.17,32.51 32.4,31.75 32.4,30.1 31.9,29.59 31.9,28.07 31.64,27.81 R20.2
N$4
  Top 0.305: 31.13,29.72 30.81,29.72 R19.2 31.51,29.97 31.9,30.35 31.9,32 32.4,32.51 32.4,33.53 32.66,33.78 IC1.4
N$5
  Top 0.305: R18.2 31.26,32.13 31.9,32.77 31.9,34.54 32.4,35.05 IC1.3
N$6
  Top 0.305: IC1.2 32.78,36.32 31.01,34.54 30.81,34.54 R17.2
N$7
  Top 0.305: IC1.1 31.9,37.59 31.13,36.83 30.94,36.83 R16.2
N$8
  Top 0.305: IC1.15 38.25,36.32 35.96,38.61 R15.2
N$9
  Top 0.305: R22.1 D13.A
N$10
  Top 0.305: R21.1 D14.A
N$11
  Top 0.305: R20.1 D17.A
N$12
  Top 0.305: R19.1 D18.A
N$13
  Top 0.305: R18.1 D19.A
N$14
  Top 0.305: R17.1 D20.A
N$15
  Top 0.305: R16.1 D21.A
N$16
  Top 0.305: R15.1 D22.A
N$17
  Top 0.305: Q3.C 10.86,33.1 SRC1.1
N$18
  Top 0.305: Q2.C 7.64,33.78 6.88,34.54 6.88,37.08 SRC2.1
N$19
  Top 0.305: Q1.C 2.56,35.31 SRC3.1
N$20
  Top 0.305: SRC4.1 17.04,37.08 17.04,33.87 Q4.C
N$21
  Top 0.305: R46.1 86.95,26.92 IC6.1
N$22
  Top 0.305: Q3.B R3.1
N$23
  Top 0.305: Q2.B R2.1
N$24
  Top 0.305: Q1.B R1.1
N$25
  Top 0.305: Q4.B R4.1
N$26  (via drill 0.6)
  Top 0.305: v21.99,23.49 D13.C
  Bottom 0.305: SINK8.1 1.8,37.08 1.8,28.7 5.1,25.4 11.98,25.4 arc-45 12.16,25.33 16.4,21.08 19.58,21.08 v21.99,23.49
N$27
  Top 0.305: R57.2 74.38,3.11 74.57,3.3 75.58,3.3 76.09,3.3 | 76.09,3.3 76.22,3.43 76.22,4.06 | 76.22,4.06 76.22,4.51 R56.1 | 76.73,4.57 76.22,4.06 | IC7.6 76.09,3.3
N$28  (via drill 0.6)
  Top 0.305: R57.1 IC7.7 v82.44,2.03
  Bottom 0.305: SIGOUT1.1 95.27,3.43 95.27,1.52 94.63,0.89 93.36,0.89 92.22,2.03 v82.44,2.03
N$29  (via drill 0.6)
  Top 0.305: v21.99,25.65 D14.C
  Bottom 0.305: SINK7.1 5.61,26.8 6.37,26.03 12.34,26.03 16.66,21.72 18.05,21.72 v21.99,25.65
N$30
  Top 0.305: R59.1 88.48,8.19 88.66,8.38 | 88.66,8.38 90.19,8.38 90.38,8.57 R58.2 | IC7.13 88.66,8.38
N$31  (via drill 0.6)
  Top 0.305: v83.71,29.97 81.04,29.97 79.9,28.83 79.9,24.64 78.63,23.37 78.63,15.88 80.54,13.97 88.16,13.97 88.54,13.59 88.54,9.71 R58.1 IC7.14
  Bottom 0.305: SIGOUT3.1 85.24,31.5 v83.71,29.97
N$32
  Top 0.61: F1.P$2 105.89,33.08 L1.2 106.06,34.46 105.93,34.59 D15.C
N$33
  Top 0.305: R34.2 62.31,29.91 62.5,30.1 64.03,30.1 | 64.03,30.1 64.21,30.29 R33.1 | IC4.6 64.03,30.1
N$34  (via drill 0.6)
  Top 0.305: SIGOUT2.1 100.35,5.97 100.35,21.34 100.98,21.97 100.98,28.32 97.17,32.13 85.24,32.13 84.47,32.77 82.31,32.77 v80.28,30.73 | R34.1 v65.68,28.83 IC4.7
  Bottom 0.305: v80.28,30.73 78.38,32.64 70.12,32.64 66.31,28.83 v65.68,28.83
N$35
  Top 0.61: 104.29,11.56 104.16,11.68 | F2.P$2 104.56,11.84 104.29,11.56 | 104.29,11.56 105.8,10.04 D16.A 105.89,9.44 L2.2
N$36
  Top 0.305: R36.1 76.03,34.99 76.22,35.18 | 76.22,35.18 77.49,35.18 77.74,35.18 77.93,35.37 R35.2 | IC4.13 76.22,35.18
N$37
  Top 0.305: SIGOUT4.1 83.97,39.62 76.98,39.62 76.03,38.67 R35.1 IC4.14
N$38
  Top 0.305: C13.2 R47.2
N$39  (via drill 0.6)
  Top 0.305: SIGIN1.1 95.27,3.43 95.27,5.33 93.49,7.11 93.49,13.21 92.09,14.6 80.79,14.6 79.9,15.49 v79.9,19.18 | R48.2 v81.3,23.11
  Bottom 0.305: v79.9,19.18 79.9,22.99 80.03,23.11 v81.3,23.11
N$40
  Top 0.305: C14.2 R50.2
N$41  (via drill 0.6)
  Top 0.305: R49.2 81.43,20.83 80.54,21.72 80.54,28.57 81.04,29.08 84.35,29.08 85.11,29.84 v85.11,29.97
  Bottom 0.305: SIGIN2.1 86.51,37.08 86.51,31.37 v85.11,29.97
N$42
  Top 0.305: R54.2 C17.2
N$43  (via drill 0.6)
  Top 0.305: R53.2 98.95,20.83 100.35,22.23 100.35,28.07 96.92,31.5 84.22,31.5 v83.97,31.75
  Bottom 0.305: SIGIN3.1 83.97,37.08 v83.97,31.75
N$44
  Top 0.305: C16.2 R51.2
N$45  (via drill 0.6)
  Top 0.305: R52.2 99.46,23.11 99.71,23.37 99.71,27.94 96.79,30.86 83.58,30.86 v82.7,31.75
  Bottom 0.305: SIGIN4.1 v82.7,31.75
N$46  (via drill 0.6)
  Top 0.305: v22.62,8.38 R24.1
  Bottom 0.305: IND1.1 14.5,3.43 19.45,3.43 22.62,6.6 v22.62,8.38
N$47
  Top 0.305: R24.2 26.88,7.87 IC2.2 IC2.1
N$48
  Top 0.305: R38.1 C8.2 R39.2 63.33,20.57 IC5.3
N$49  (via drill 0.6)
  Top 0.305: v21.99,27.81 D17.C
  Bottom 0.305: SINK6.1 6.88,37.08 6.88,26.92 7.13,26.67 12.46,26.67 16.78,22.35 17.93,22.35 20.97,25.4 20.97,26.8 v21.99,27.81
N$50
  Top 0.305: IC2.6 IC2.7 | R27.2 IC2.7 | 31.77,1.52 IC2.7
N$51
  Top 0.305: IND2.1 11.96,0.89 23.83,0.89 R27.1
N$52
  Top 0.305: C9.2 R41.1 R40.2 63.33,18.03 IC5.5
N$53  (via drill 0.6)
  Top 0.305: IC2.9 IC2.8 36.91,2.1 36.85,2.16 v38.75,2.16 | v28.21,3.81 R26.2
  Bottom 0.305: v38.75,2.16 29.86,2.16 v28.21,3.81
N$54  (via drill 0.6)
  Top 0.305: v22.75,3.81 R26.1
  Bottom 0.305: IND3.1 9.42,0.89 18.94,0.89 21.86,3.81 v22.75,3.81
N$55
  Top 0.305: IC5.10 73.87,18.03 R44.2 C12.2 R45.1
N$56  (via drill 0.6)
  Top 0.305: IC2.14 36.91,8.38 | 36.91,8.38 IC2.13 | v38.63,8.51 37.04,8.51 36.91,8.38 | R23.2 27.7,10.67 28.09,10.41 v28.09,9.02
  Bottom 0.305: v28.09,9.02 29.23,7.87 37.99,7.87 v38.63,8.51
N$57  (via drill 0.6)
  Top 0.305: v22.88,10.67 R23.1
  Bottom 0.305: IND4.1 5.61,6.1 6.75,7.24 17.8,7.24 20.72,10.16 22.37,10.16 v22.88,10.67
N$58
  Top 0.305: R42.1 C11.2 R43.2 73.87,20.57 IC5.12
N$59  (via drill 0.6)
  Top 0.305: v21.86,29.97 D18.C
  Bottom 0.305: SINK5.1 10.69,30.86 11.58,29.97 v21.86,29.97
N$60  (via drill 0.6)
  Top 0.305: FR_ATT2.1 86.51,34.54 81.3,34.54 80.41,35.43 v80.41,37.08 | R33.2 v60.72,31.37
  Bottom 0.305: 61.61,31.37 v60.72,31.37 63.01,31.37 63.26,31.62 63.26,36.45 63.39,36.58 66.82,36.58 67.33,37.08 v80.41,37.08
N$61
  Top 0.305: R13.1 14.5,3.43 GATE1.1
N$62  (via drill 0.6)
  Top 0.305: v52.22,35.94 52.22,37.59 53.23,38.61 53.93,38.61 R30.1
  Bottom 0.305: v52.22,35.94 52.22,34.04 52.98,33.27 IC9.7
N$63
  Top 0.61: POWER.10 104.92,16.76 | 104.92,16.76 POWER.9 | F2.P$1 104.67,16.51 104.92,16.76
N$64
  Top 0.305: 49.93,25.67 D11.A 50.43,33.27 | R29.2 50.43,38.04 50.43,33.27 | IC9.2 50.43,33.27
N$65
  Top 0.305: D11.C 49.68,27.15 49.68,30.48 49.42,30.73 IC9.3
  Bottom 0.305: MIDI_IN-.1 20.97,35.81 21.35,35.43 24.15,35.43 27.83,39.12 39.9,39.12 43.2,35.81 43.2,33.27 45.74,30.73 IC9.3
N$66  (via drill 0.6)
  Top 0.305: R29.1 v46.25,38.48
  Bottom 0.305: MIDI_IN+.1 19.58,39.62 45.1,39.62 v46.25,38.48
N$67
  Top 0.305: R12.1 11.96,5.97 GATE2.1
N$68
  Top 0.305: GATE3.1 9.42,5.97 R11.1
N$69
  Top 0.305: GATE4.1 6.88,3.43 R10.1
N$70  (via drill 0.6)
  Top 0.305: v91.84,7.11 R59.2
  Bottom 0.305: FR_ATT3.1 102.63,6.22 92.73,6.22 v91.84,7.11
N$71
  Top 0.305: FR_ATT4.1 90.95,33.91 R36.2
N$72  (via drill 0.6)
  Top 0.305: D19.C 23.54,32 v21.86,32
  Bottom 0.305: SINK4.1 11.96,37.08 11.96,31.11 12.46,30.61 20.47,30.61 v21.86,32
N$73  (via drill 0.6)
  Top 0.305: D20.C v21.87,34.3 v21.86,34.29
  Bottom 0.305: v21.86,34.29 14.75,34.29 SINK3.1
N$75
  Top 0.61: POWER.2 104.67,26.92 | 104.67,26.92 POWER.1 | 104.67,26.92 104.67,28.85 F1.P$1
N$76  (via drill 0.6)
  Top 0.305: D21.C v22.12,36.45
  Bottom 0.305: v22.12,36.45 19.58,36.45 18.94,37.08 17.04,37.08 SINK2.1
N$77
  Top 0.305: SINK1.1 14.5,39.62 22.79,39.62 D22.C
PWM1  (via drill 0.6)
  Top 0.305: IC2.3 v33.55,6.6 | IC3.7 v48.02,12.32 54.5,18.8 57.8,18.8 59.45,20.45 R39.1
  Bottom 0.305: v33.55,6.6 44.85,6.6 48.02,9.78 48.02,11.56 48.02,11.68 v48.02,12.32
PWM2  (via drill 0.6)
  Top 0.305: IC2.5 v33.29,4.06 | IC3.8 v49.29,12.32 49.29,12.7 54.76,18.16 R40.1
  Bottom 0.305: v33.29,4.06 33.93,4.06 35.83,5.97 45.1,5.97 49.29,10.16 v49.29,12.32 49.29,11.56
PWM3  (via drill 0.6)
  Top 0.305: IC3.17 v44.21,18.54 | v53.1,12.32 53.1,9.4 52.47,8.76 46.12,8.76 45.48,8.13 42.31,8.13 40.15,5.97 40.15,4.7 39.52,4.06 IC2.10 | R44.1 v77.62,18.16
  Bottom 0.305: v44.21,18.54 53.1,18.54 | v53.1,12.32 53.1,18.54 | 53.1,18.54 57.3,18.54 57.68,18.16 v77.62,18.16
PWM4  (via drill 0.6)
  Top 0.305: v55.26,20.32 55.01,20.32 48.02,13.34 45.87,13.34 45.48,12.95 IC3.5 45.48,9.02 45.1,8.64 42.06,8.64 40.02,6.6 IC2.12 | R43.1 v77.62,20.45
  Bottom 0.305: v77.62,20.45 55.39,20.45 v55.26,20.32
SR_RCK  (via drill 0.6)
  Top 0.305: IC3.2 41.67,11.94 40.15,13.46 33.8,13.46 33.42,13.08 30.5,13.08 29.23,14.35 v29.23,14.6 | IC1.12 v39.13,32.51
  Bottom 0.305: v39.13,32.51 35.58,32.51 29.23,28.19 v29.23,14.6
SR_SCK  (via drill 0.6)
  Top 0.305: IC1.11 v38.37,31.24 | IC3.3 42.94,11.81 40.66,14.1 33.55,14.1 33.17,13.72 31.9,13.72 v31.01,14.6
  Bottom 0.305: v38.37,31.24 35.2,31.24 29.86,27.94 29.86,15.75 v31.01,14.6
SWITCH  (via drill 0.6)
  Top 0.305: IC3.4 v44.21,12.32 44.21,14.22 43.71,14.73 33.17,14.73 33.04,14.6 v32.53,14.6
  Bottom 0.305: SWITCH.1 13.23,5.84 13.99,6.6 18.05,6.6 20.97,9.52 27.07,9.52 27.96,10.41 36.85,10.41 39.01,12.57 43.96,12.57 v44.21,12.32 | v32.53,14.6 32.53,22.23 36.34,26.03 39.26,26.03 40.28,25.02 ICSP.1
TO_ATT1  (via drill 0.6)
  Top 0.305: R55.1 v74.38,8.36 | 74.44,9.71 C18.2 v74.38,8.36 | v74.38,8.36 74.38,6.03 74.57,5.84 v77.74,5.84 | v77.74,9.65 IC7.1
  Bottom 0.305: TO_ATT1.1 92.09,4.06 91.08,4.06 88.54,6.6 78.5,6.6 v77.74,5.84 | v74.38,8.36 75.67,9.65 v77.74,9.65
TO_ATT2  (via drill 0.6)
  Top 0.305: C5.2 R32.1 62.31,37.53 62.5,37.72 v66.25,37.72 67.07,37.72 67.46,37.34 67.46,36.52 IC4.1 | TO_ATT2.1 89.05,37.08 82.06,37.08 80.79,38.35 v77.36,38.35
  Bottom 0.305: v66.25,37.72 66.89,38.35 v77.36,38.35
TO_ATT3
  Top 0.305: R60.1 C20.2 90.38,0.82 90.19,0.63 | 90.19,0.63 86.51,0.63 85.11,2.03 IC7.8 | TO_ATT3.1 100.35,3.43 100.35,1.52 99.46,0.63 90.19,0.63
TO_ATT4  (via drill 0.6)
  Top 0.305: v80.28,32.51 79.14,31.37 R37.1 C10.2 77.93,27.75 77.62,27.43 74.44,27.43 73.04,28.83 IC4.8
  Bottom 0.305: TO_ATT4.1 91.59,39.62 82.06,39.62 81.43,38.99 81.43,33.66 v80.28,32.51
VCACV1  (via drill 0.6)
  Top 0.305: IC5.2 IC5.1 66,24.19 v65.55,24.64 | IC6.3 v89.17,23.88
  Bottom 0.305: v89.17,23.88 89.17,24.26 88.92,24.51 72.03,24.51 71.77,24.26 65.93,24.26 v65.55,24.64
VCACV2  (via drill 0.6)
  Top 0.305: IC5.6 IC5.7 66,15.18 v65.3,14.48 | IC6.6 v89.17,20.07
  Bottom 0.305: 89.05,20.07 v89.17,20.07 89.17,19.05 87.52,17.4 68.22,17.4 v65.3,14.48
VCACV3  (via drill 0.6)
  Top 0.305: 71.14,16.7 IC5.9 IC5.8 71.2,14.67 71.52,14.35 v72.28,14.35 | v90.95,20.07 IC6.11
  Bottom 0.305: v72.28,14.35 77.62,14.35 80.03,16.76 87.65,16.76 v90.95,20.07
VCACV4  (via drill 0.6)
  Top 0.305: IC5.13 IC5.14 71.2,24.95 v71.39,25.15 | IC6.14 v90.95,23.88
  Bottom 0.305: v90.95,23.88 90.95,24.64 90.44,25.15 v71.39,25.15
VCAIN1
  Top 0.305: R48.1 84.66,24.89 | 84.66,24.89 R47.1 | IC6.2 84.92,25.15 84.66,24.89
VCAIN2
  Top 0.305: IC6.7 85.11,18.8 | 85.11,18.8 84.92,18.8 R50.1 | R49.1 84.66,19.24 85.11,18.8
VCAIN3
  Top 0.305: R53.1 R54.1 95.21,18.8 IC6.10
VCAIN4
  Top 0.305: IC6.15 95.21,25.15 R51.1 R52.1
VCAOUT1  (via drill 0.6)
  Top 0.305: R55.2 76.28,8.38 | 76.28,8.38 C18.1 76.28,11.74 v78,13.46 | IC6.4 89.55,22.61 90.06,22.1 v90.06,15.75 | IC7.2 76.28,8.38
  Bottom 0.305: v78,13.46 87.78,13.46 v90.06,15.75
VCAOUT2  (via drill 0.6)
  Top 0.305: C5.1 64.21,35.18 | 64.21,35.18 R32.2 | v89.17,21.34 IC6.5 | v72.79,27.43 73.04,27.43 73.81,26.67 76.98,26.67 77.49,26.16 77.49,23.75 v77.62,23.62 | IC4.2 v65.73,35.18 64.21,35.18
  Bottom 0.305: v89.17,21.34 88.54,21.34 86,23.88 77.87,23.88 v77.62,23.62 | v72.79,27.43 64.92,27.43 64.28,28.07 64.28,33.73 v65.73,35.18
VCAOUT3  (via drill 0.6)
  Top 0.305: C20.1 88.48,3.3 | 88.48,3.3 R60.2 88.48,5.65 88.66,5.84 91.97,5.84 92.73,6.6 v92.73,11.68 | IC6.12 v90.95,21.34 | IC7.9 88.48,3.3
  Bottom 0.305: v90.95,21.34 91.97,21.34 92.73,20.57 v92.73,11.68
VCAOUT4  (via drill 0.6)
  Top 0.305: C10.1 76.03,30.1 | 76.03,30.1 76.03,30.73 | 76.03,30.73 R37.2 | 75.58,31.37 76.22,30.73 76.03,30.73 | IC6.13 v90.95,22.61 | IC4.9 v74.44,30.1 76.03,30.1
  Bottom 0.305: v90.95,22.61 91.97,22.61 91.97,24.51 90.7,25.78 83.97,25.78 79.65,30.1 v74.44,30.1

### Text on the board
bPlace: DIGITALLY CONTROLLED QUAD VCA/MIXER | -12V | MAIN BOARD V1 | hotchk155